# Altium schematic sheet ROL2-C1-P02.SchDoc
size A3
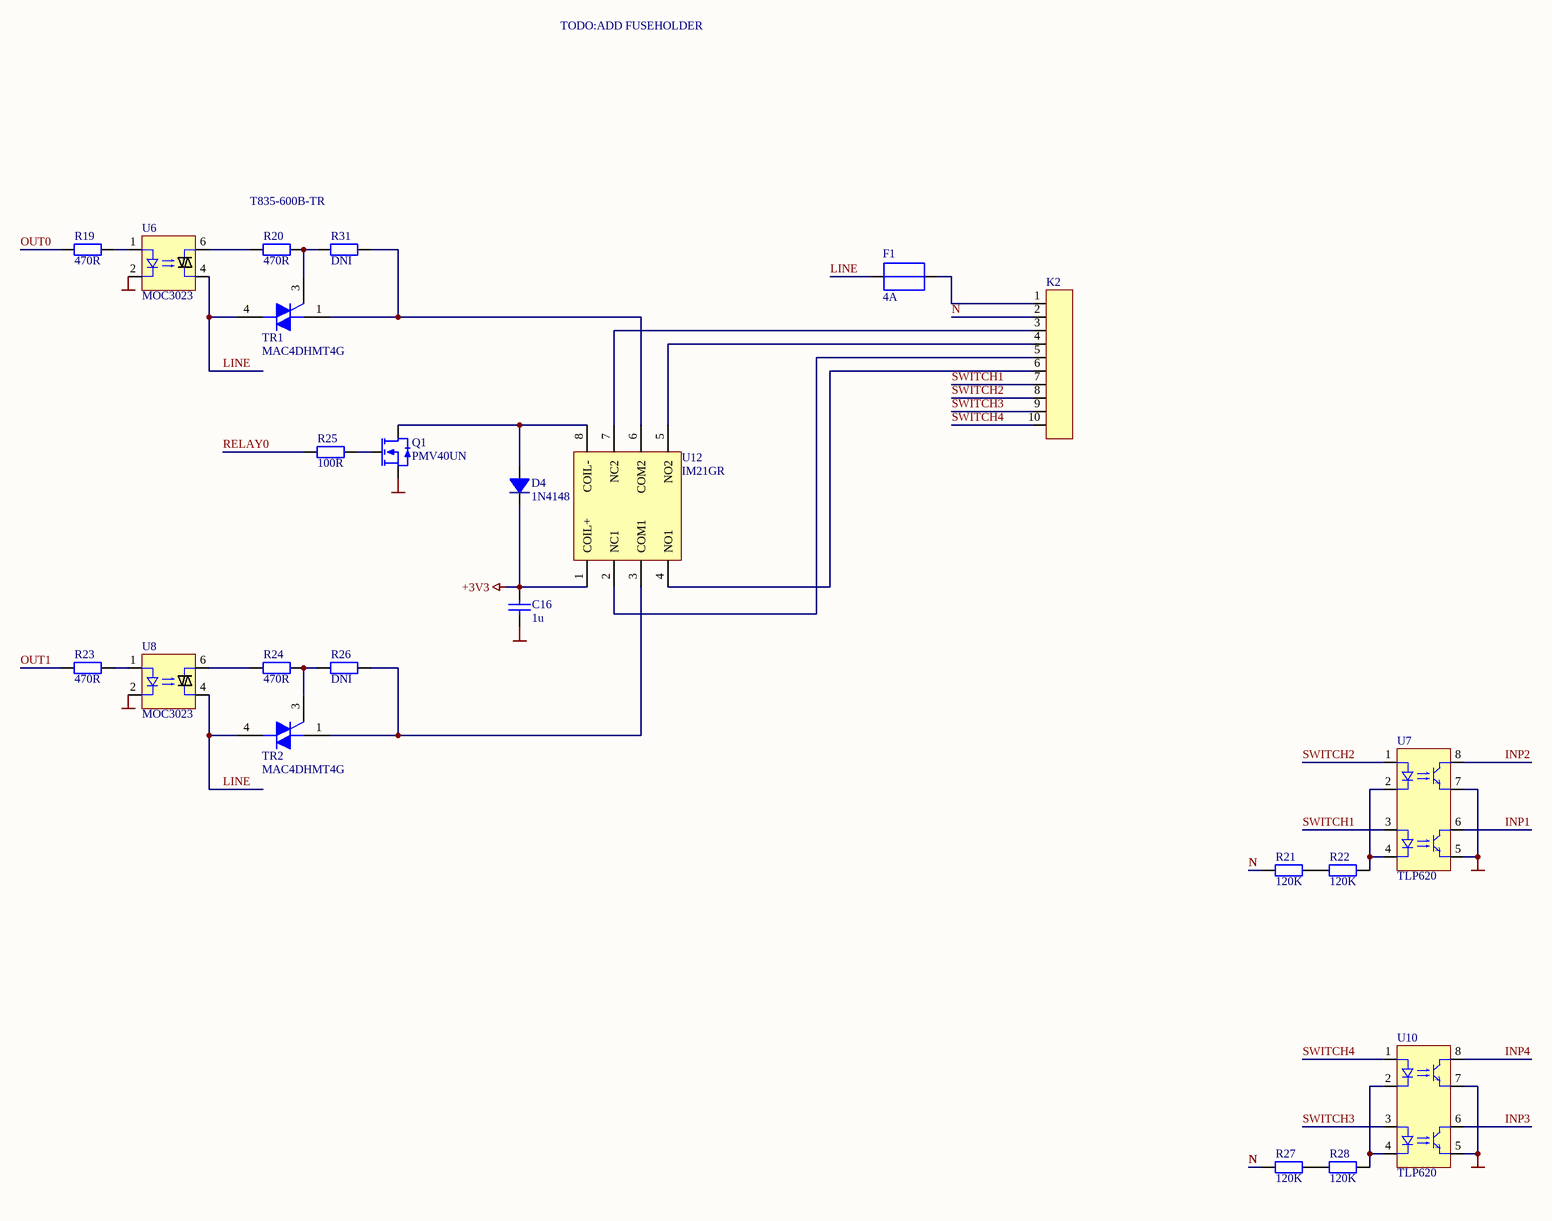
[diagram p0: ROL2-C1-P02.SchDoc]

## Parts
C16  1u  [CC0805-1]
D4  1N4148  [SOD-123]
F1  4A  [FUSE-SMD-12mm]
K2  Terminal Block Connector, 3.81mm, Right Angle  [CONN_3.81_10]  (value not drawn)
Q1  PMV40UN  [SOT23-1]
R19  470R  [RC0805-1]
R20  470R  [RC0805-1]
R21  120K  [RC1206-1]
R22  120K  [RC1206-1]
R23  470R  [RC0805-1]
R24  470R  [RC0805-1]
R25  100R  [RC0805-1]
R26  DNI  [RC0805-1]
R27  120K  [RC1206-1]
R28  120K  [RC1206-1]
R31  DNI  [RC0805-1]
TR1  MAC4DHMT4G  [ONSC-DPAK-3-369C-01_V]
TR2  MAC4DHMT4G  [ONSC-DPAK-3-369C-01_V]
U6  MOC3023  [DIP6]
U7  TLP620  [DIP8]
U8  MOC3023  [DIP6]
U10  TLP620  [DIP8]
U12  IM21GR  [RELAY-SMD-2A]

## Nets
+3V3: C16.2 D4.1(C) U12.1(COIL+)
GND: C16.1 Q1.2(S) U6.2(K) U7.5(E) U7.7(E) U8.2(K) U10.5(E) U10.7(E)
INP1: U7.6(C)
INP2: U7.8(C)
INP3: U10.6(C)
INP4: U10.8(C)
LINE: F1.1(OUT) TR1.4(MT2) TR2.4(MT2) U6.4(E) U8.4(E)
N: K2.2(K) R21.1 R27.1
OUT0: R19.2
OUT1: R23.2
RELAY0: R25.2
SWITCH1: K2.7(E) U7.3(A)
SWITCH2: K2.8(C) U7.1(A)
SWITCH3: K2.9(C) U10.3(A)
SWITCH4: K2.10(C) U10.1(A)
NetD4_2: D4.2(A) Q1.3(D) U12.8(COIL-)
NetF1_2: F1.2(IN) K2.1(A)
NetK2_3: K2.3(A) U12.7(NC2)
NetK2_4: K2.4(K) U12.5(NO2)
NetK2_5: K2.5(E) U12.2(NC1)
NetK2_6: K2.6(C) U12.4(NO1)
NetQ1_1: Q1.1(G) R25.1
NetR19_1: R19.1 U6.1(A)
NetR20_1: R20.1 R31.2 TR1.3(G)
NetR20_2: R20.2 U6.6(C)
NetR21_2: R21.2 R22.1
NetR22_2: R22.2 U7.2(K) U7.4(K)
NetR23_1: R23.1 U8.1(A)
NetR24_1: R24.1 R26.2 TR2.3(G)
NetR24_2: R24.2 U8.6(C)
NetR26_1: R26.1 TR2.1(MT1) U12.3(COM1)
NetR27_2: R27.2 R28.1
NetR28_2: R28.2 U10.2(K) U10.4(K)
NetR31_1: R31.1 TR1.1(MT1) U12.6(COM2)

## Notes on the sheet
- TODO:ADD FUSEHOLDER
- T835-600B-TR
- Title
- Size:
- Date:
- A3
- Number:
- Time:
- Revision:
- Sheet
- of
- File:

## Library data of the parts
C16 = CAPCC0805_1U50VX7R: Capacitor chip ceramic 0805; Comment2: 50V X7R 10%; Sort: 210; Tech: SMDR; Code: *; Manufacturer: *; Manufacturer No: *; Price: *; Package: Cap Chip 0805; Supplier: *; Supplier No: *
D4 = D-1N4148WS: Small Signal Diode; Manufacturer: Vishay; Manufacturer No: 1N4148WS-V-GS18; Sort: 430; Comment2: 100V 150mA; Tech: SMDR; Code: *; Price: *; Package: SOD323; Supplier: Farnell; Supplier No: 1612348
F1 = FUSE-4A-0464004.DR: SMD Fuse; Code: *; Manufacturer No: 0464004.DR; Price: *; Tech: *
K2 = CONN_TB_3.81_10PIN: Terminal Block Connector, 3.81mm, 8pin
Q1 = Q-PMV40UN: TrenchMOS ultra low level FET N-channel; Manufacturer: NXP; Manufacturer No: PMV40UN,215; Comment2: 30V, 4.9A; Sort: 440; Tech: SMDR; Package: SOT23; Price: *; Supplier: Farnell; Supplier No: 1758117RL
R19 R20 R23-R26 R31 = RES0805: Chip Resistor 0805; Comment2: 0.125W 1% 200ppm; Sort: 110; Tech: SMDR; Package: Res Chip 0805; Price: 0.002
R21 R22 R27 R28 = RES1206: Chip Resistor 1206; Comment2: 0.25W 1% 200ppm; Sort: 110; Tech: SMDR; Package: Res Chip 1206; Price: 0.002
TR1 TR2 = MAC4DHMT4G: Sensitive Gate Triacs, 3-Pin DPAK, Pb-Free, Tape and Reel; Manufacturer: On Semiconductor; IT(RMS) Max (A): 4; ITSM Max (A): 40; DatasheetVersion: Rev. 6; PackageVersion: Rev. E, 02/2014; PackageReference: DPAK-3-369C-01; PackageDescription: 3-Pin Flange Mount, Body 6.54 x 6.095 mm, Pitch 2.29 mm; Supplier 1: Digi-Key; Supplier Part Number 1: MAC4DHMT4GOSTR-ND; Supplier 2: Digi-Key; Supplier Part Number 2: MAC4DHMT4GOSCT-ND; Supplier 3: Digi-Key; Supplier Part Number 3: MAC4DHMT4GOSDKR-ND; Supplier 4: Farnell; Supplier Part Number 4: 1258364; Supplier 5: Newark; Supplier Part Number 5: 41K9936; Supplier 6: Mouser; Supplier Part Number 6: 863-MAC4DHMT4G; Packing: Tape and Reel; RoHS: Pb-Free; Mounting Technology: Surface Mount; PartNumber: MAC4DHMT4G; ComponentLink1Description: Manufacturer URL; ComponentLink1URL: http://www.onsemi.com/; ComponentLink2Description: Datasheet; ComponentLink2URL: http://www.onsemi.com/pub_link/Collateral/MAC4DHM-D.PDF; ComponentLink3Description: Package Specification; ComponentLink3URL: http://www.onsemi.cn/pub_link/Collateral/369C.PDF
U6 U8 = MOC3023: digital temperature sensor
U7 U10 = TLP620: digital temperature sensor
U12 = relay-SMD-IM21GR: relay SMD 250VAC 2A